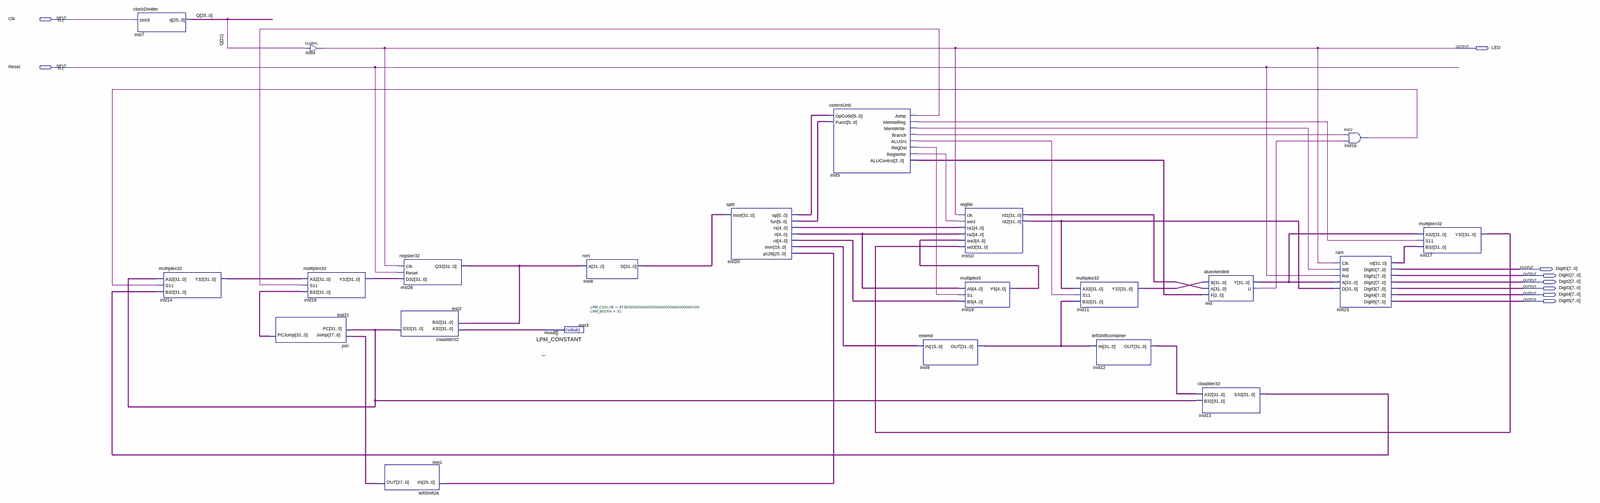
[diagram p0: schematic sheet, whole]
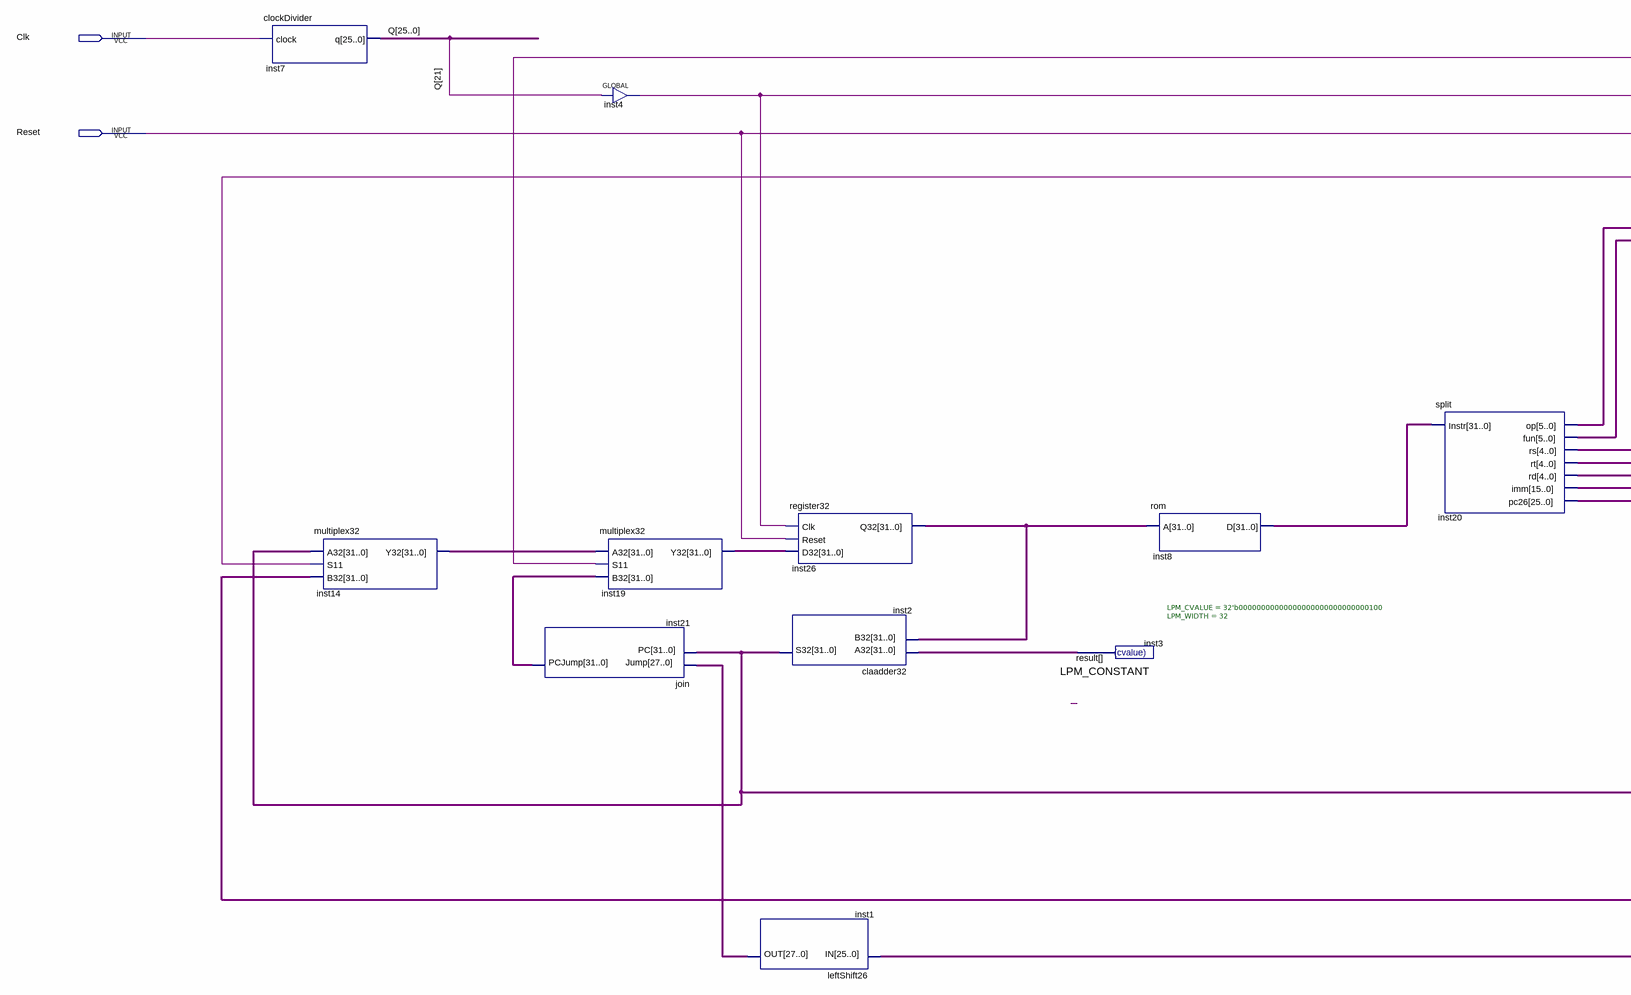
[diagram p1: schematic sheet, left part]
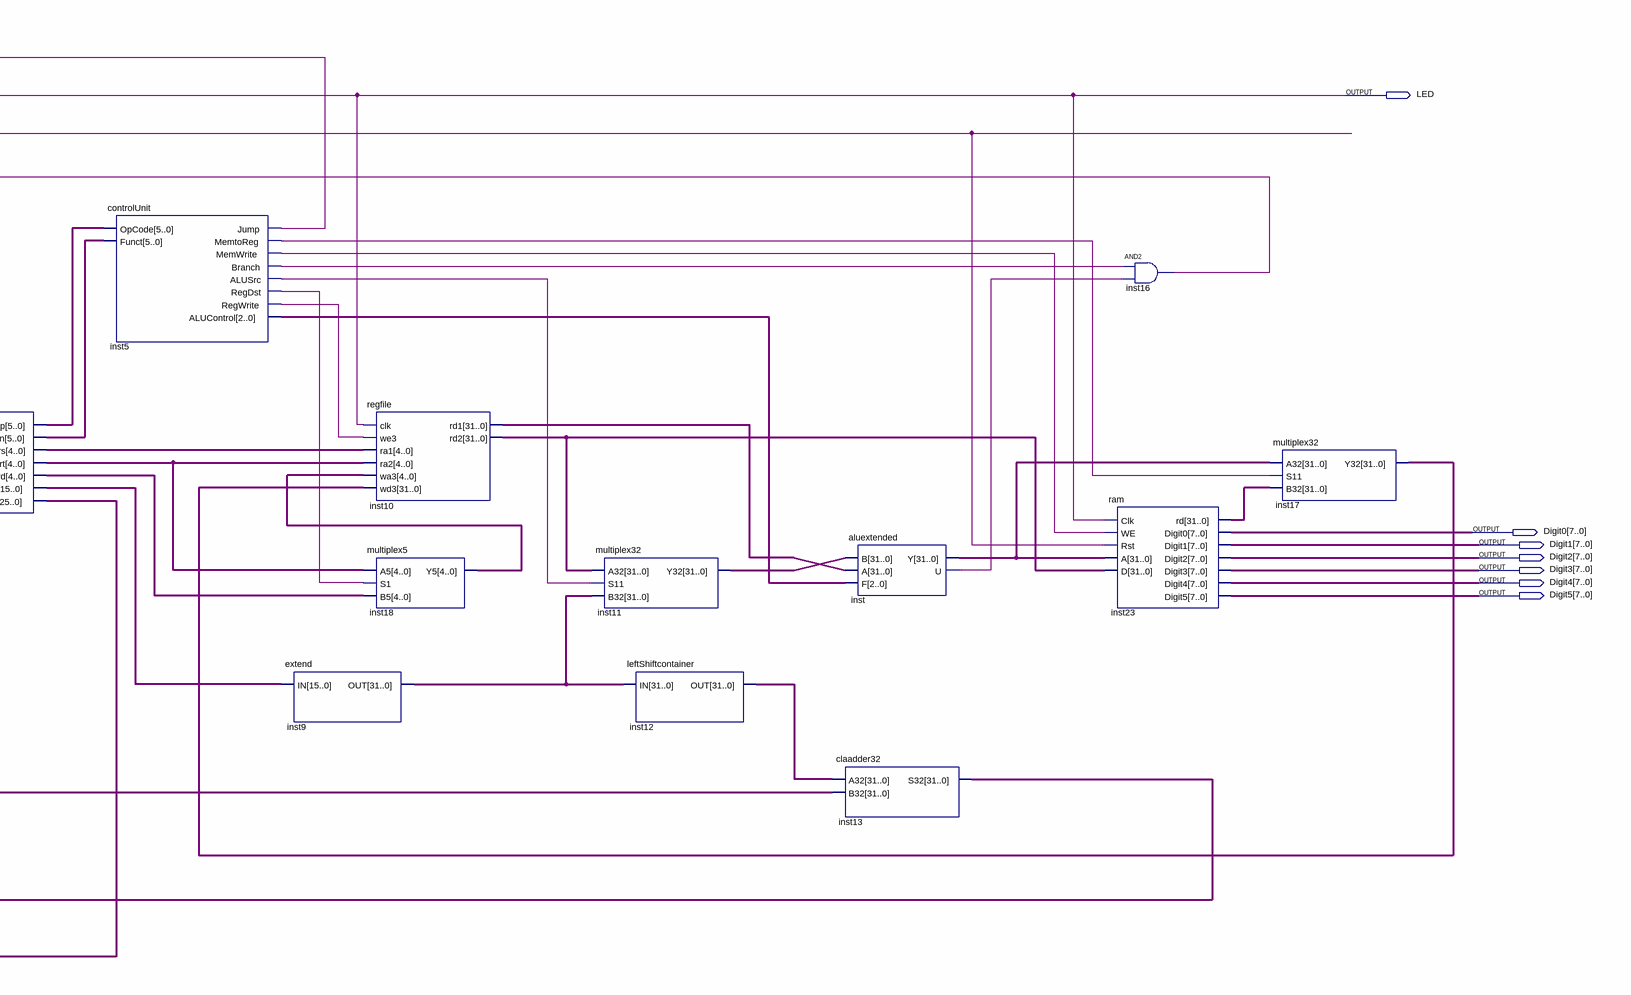
[diagram p2: schematic sheet, right part]
// Quartus schematic processor.bdf as structural Verilog: 22 symbols, 9 pins
module processor (
  input  Clk,
  input  Reset,
  output LED,
  output [7:0] Digit0,
  output [7:0] Digit1,
  output [7:0] Digit2,
  output [7:0] Digit3,
  output [7:0] Digit4,
  output [7:0] Digit5
);

  wire inst5_alusrc, inst5_branch, inst5_jump, inst5_memtoreg, inst5_memwrite, inst5_regdst, inst5_regwrite,
       inst16_out, inst_u;
  wire [2:0] inst5_alucontrol;
  wire [4:0] inst18_y5, inst20_rd, inst20_rs, inst20_rt;
  wire [5:0] inst20_fun, inst20_op;
  wire [15:0] inst20_imm;
  wire [25:0] inst20_pc26, Q;
  wire [27:0] inst1_out;
  wire [31:0] inst2_s32, inst3_result, inst8_d, inst9_out, inst10_rd1, inst10_rd2, inst11_y32, inst12_out,
       inst13_s32, inst14_y32, inst17_y32, inst19_y32, inst21_pcjump, inst23_rd, inst26_q32, inst_y;

  clockDivider inst7 (.clock(Clk), .q(Q));
  multiplex32 inst14 (.A32(inst2_s32), .S11(inst16_out), .B32(inst13_s32), .Y32(inst14_y32));
  \join  inst21 (.Jump(inst1_out), .PC(inst2_s32), .PCJump(inst21_pcjump));
  multiplex32 inst19 (.A32(inst14_y32), .S11(inst5_jump), .B32(inst21_pcjump), .Y32(inst19_y32));
  GLOBAL inst4 (.IN(Q[21]), .OUT(LED));
  leftShift26 inst1 (.IN(inst20_pc26), .OUT(inst1_out));
  register32 inst26 (.Clk(LED), .Reset(Reset), .D32(inst19_y32), .Q32(inst26_q32));
  claadder32 inst2 (.A32(inst3_result), .B32(inst26_q32), .S32(inst2_s32));
  LPM_CONSTANT #(.LPM_CVALUE(32'b00000000000000000000000000000100), .LPM_WIDTH(32)) inst3 (.result(inst3_result));
  rom inst8 (.A(inst26_q32), .D(inst8_d));
  split inst20 (
    .Instr(inst8_d), .op(inst20_op), .fun(inst20_fun), .rs(inst20_rs), .rt(inst20_rt), .rd(inst20_rd),
    .imm(inst20_imm), .pc26(inst20_pc26));
  controlUnit inst5 (
    .OpCode(inst20_op), .Funct(inst20_fun), .Jump(inst5_jump), .MemtoReg(inst5_memtoreg),
    .MemWrite(inst5_memwrite), .Branch(inst5_branch), .ALUSrc(inst5_alusrc), .RegDst(inst5_regdst),
    .RegWrite(inst5_regwrite), .ALUControl(inst5_alucontrol));
  extend inst9 (.IN(inst20_imm), .OUT(inst9_out));
  regfile inst10 (
    .clk(LED), .we3(inst5_regwrite), .ra1(inst20_rs), .ra2(inst20_rt), .wa3(inst18_y5), .wd3(inst17_y32),
    .rd1(inst10_rd1), .rd2(inst10_rd2));
  multiplex5 inst18 (.A5(inst20_rt), .S1(inst5_regdst), .B5(inst20_rd), .Y5(inst18_y5));
  multiplex32 inst11 (.A32(inst10_rd2), .S11(inst5_alusrc), .B32(inst9_out), .Y32(inst11_y32));
  leftShiftcontainer inst12 (.IN(inst9_out), .OUT(inst12_out));
  claadder32 inst13 (.A32(inst12_out), .B32(inst2_s32), .S32(inst13_s32));
  aluextended inst (.B(inst11_y32), .A(inst10_rd1), .F(inst5_alucontrol), .Y(inst_y), .U(inst_u));
  and inst16 (inst16_out, inst5_branch, inst_u);
  ram inst23 (
    .Clk(LED), .WE(inst5_memwrite), .Rst(Reset), .A(inst_y), .D(inst10_rd2), .rd(inst23_rd), .Digit0(Digit0),
    .Digit1(Digit1), .Digit2(Digit2), .Digit3(Digit3), .Digit4(Digit4), .Digit5(Digit5));
  multiplex32 inst17 (.A32(inst_y), .S11(inst5_memtoreg), .B32(inst23_rd), .Y32(inst17_y32));
endmodule
